# EAGLE design 555-piano-pad (EAGLE 7.6.0)
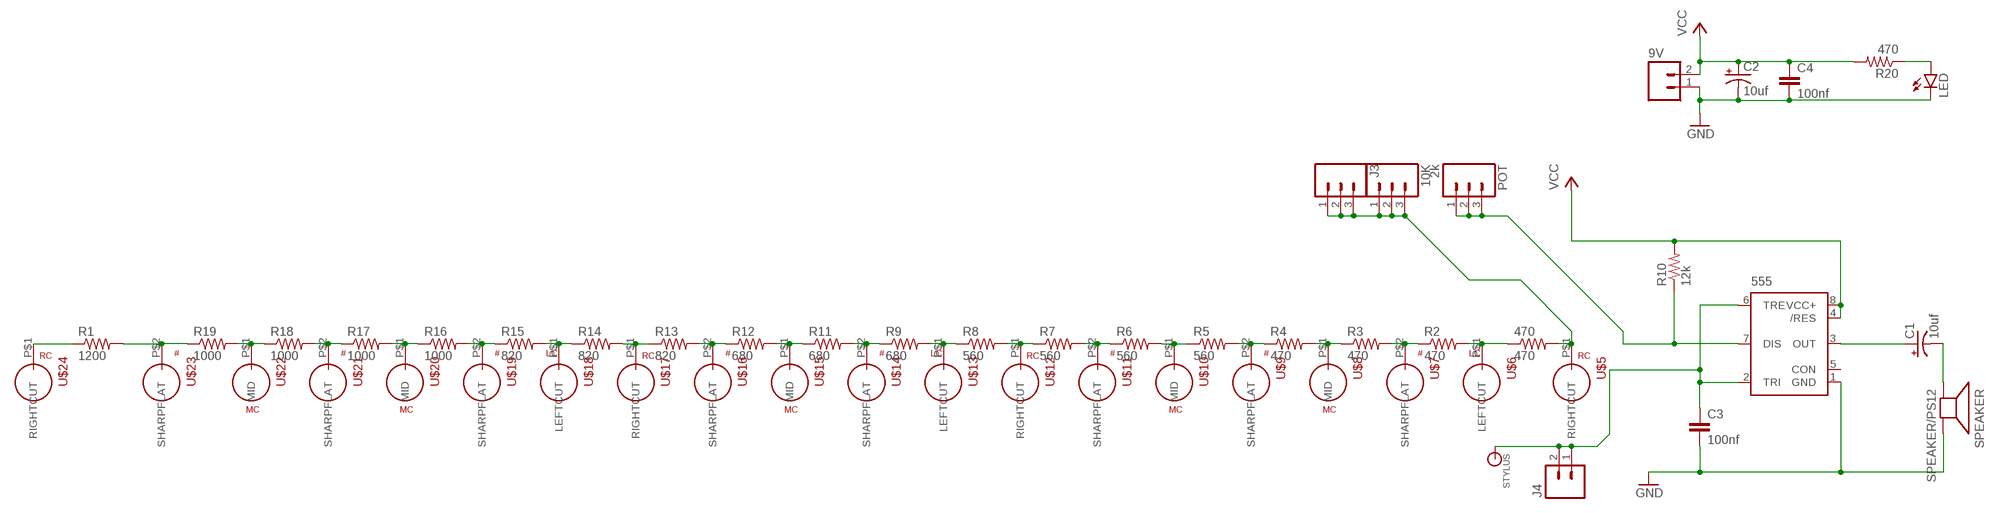
[diagram p0: schematic, sheet 1]

## Parts
9V  M02PTH3  [1X02_LONGPADS]
10K  M03PTH  [1X03]
470  470  RESISTORAXIAL-0.3  [AXIAL-0.3]
555  NE555P  [DIL-08]
C1  10uf  10UF-25V-20%(PTH)  [CPOL-RADIAL-10UF-25V]
C2  10uf  10UF-25V-20%(PTH)  [CPOL-RADIAL-10UF-25V]
C3  100nf  CAPPTH2  [CAP-PTH-SMALL2]
C4  100nf  CAPPTH2  [CAP-PTH-SMALL2]
J3  M03PTH  [1X03]
J4  M02PTH3  [1X02_LONGPADS]
LED  LED5MM  [LED5MM]
POT  2k  M03PTH  [1X03]
R1  1200  RESISTORAXIAL-0.3  [AXIAL-0.3]
R2  470  RESISTORAXIAL-0.3  [AXIAL-0.3]
R3  470  RESISTORAXIAL-0.3  [AXIAL-0.3]
R4  470  RESISTORAXIAL-0.3  [AXIAL-0.3]
R5  560  RESISTORAXIAL-0.3  [AXIAL-0.3]
R6  560  RESISTORAXIAL-0.3  [AXIAL-0.3]
R7  560  RESISTORAXIAL-0.3  [AXIAL-0.3]
R8  560  RESISTORAXIAL-0.3  [AXIAL-0.3]
R9  680  RESISTORAXIAL-0.3  [AXIAL-0.3]
R10  12k  RESISTORAXIAL-0.3  [AXIAL-0.3]
R11  680  RESISTORAXIAL-0.3  [AXIAL-0.3]
R12  680  RESISTORAXIAL-0.3  [AXIAL-0.3]
R13  820  RESISTORAXIAL-0.3  [AXIAL-0.3]
R14  820  RESISTORAXIAL-0.3  [AXIAL-0.3]
R15  820  RESISTORAXIAL-0.3  [AXIAL-0.3]
R16  1000  RESISTORAXIAL-0.3  [AXIAL-0.3]
R17  1000  RESISTORAXIAL-0.3  [AXIAL-0.3]
R18  1000  RESISTORAXIAL-0.3  [AXIAL-0.3]
R19  1000  RESISTORAXIAL-0.3  [AXIAL-0.3]
R20  470  RESISTORAXIAL-0.3  [AXIAL-0.3]
SPEAKER  SPEAKER/PS12  [PS12]
STYLUS  BANANA_CONN  [BANANA_CONN]
U$5  PINANO-RIGHT-CUT  [PINANO-RIGHT-CUT]
U$6  PINANO-LEFT-CUT  [PINANO-LEFT-CUT]
U$7  PINANO-SHARPFLAT  [PINANO-SHARPFLAT]
U$8  PINANO-MID  [PINANO-MID]
U$9  PINANO-SHARPFLAT  [PINANO-SHARPFLAT]
U$10  PINANO-MID  [PINANO-MID]
U$11  PINANO-SHARPFLAT  [PINANO-SHARPFLAT]
U$12  PINANO-RIGHT-CUT  [PINANO-RIGHT-CUT]
U$13  PINANO-LEFT-CUT  [PINANO-LEFT-CUT]
U$14  PINANO-SHARPFLAT  [PINANO-SHARPFLAT]
U$15  PINANO-MID  [PINANO-MID]
U$16  PINANO-SHARPFLAT  [PINANO-SHARPFLAT]
U$17  PINANO-RIGHT-CUT  [PINANO-RIGHT-CUT]
U$18  PINANO-LEFT-CUT  [PINANO-LEFT-CUT]
U$19  PINANO-SHARPFLAT  [PINANO-SHARPFLAT]
U$20  PINANO-MID  [PINANO-MID]
U$21  PINANO-SHARPFLAT  [PINANO-SHARPFLAT]
U$22  PINANO-MID  [PINANO-MID]
U$23  PINANO-SHARPFLAT  [PINANO-SHARPFLAT]
U$24  PINANO-RIGHT-CUT  [PINANO-RIGHT-CUT]

## Nets
GND: 9V.1 555.1(GND) C2.2(-) C3.2 C4.2 LED.K(C) SPEAKER.P$2(-)
N$1: C1.2(-) SPEAKER.P$1(+)
N$2: 10K.1 10K.2 10K.3 470.P$2 J3.1 J3.2 J3.3 U$5.P$1(RIGHTCUT)
N$3: 470.P$1 R2.P$2 U$6.P$1(LEFTCUT)
N$4: R2.P$1 R3.P$2 U$7.P$2(SHARPFLAT)
N$5: R3.P$1 R4.P$2 U$8.P$1(MID)
N$6: R4.P$1 R5.P$2 U$9.P$2(SHARPFLAT)
N$7: R5.P$1 R6.P$2 U$10.P$1(MID)
N$8: 555.3(OUT) C1.1(+)
N$9: R6.P$1 R7.P$2 U$11.P$2(SHARPFLAT)
N$10: R7.P$1 R8.P$2 U$12.P$1(RIGHTCUT)
N$11: R8.P$1 R9.P$2 U$13.P$1(LEFTCUT)
N$12: R9.P$1 R11.P$2 U$14.P$2(SHARPFLAT)
N$13: R11.P$1 R12.P$2 U$15.P$1(MID)
N$14: R12.P$1 R13.P$2 U$16.P$2(SHARPFLAT)
N$15: R13.P$1 R14.P$2 U$17.P$1(RIGHTCUT)
N$16: R14.P$1 R15.P$2 U$18.P$1(LEFTCUT)
N$17: R15.P$1 R16.P$2 U$19.P$2(SHARPFLAT)
N$18: 555.2(TRI) 555.6(TRE) C3.1 J4.1 J4.2 STYLUS.P$1
N$19: R16.P$1 R17.P$2 U$20.P$1(MID)
N$20: 555.7(DIS) POT.1 POT.2 POT.3 R10.P$1
N$21: R17.P$1 R18.P$2 U$21.P$2(SHARPFLAT)
N$22: R18.P$1 R19.P$2 U$22.P$1(MID)
N$23: R1.P$2 R19.P$1 U$23.P$2(SHARPFLAT)
N$24: R1.P$1 U$24.P$1(RIGHTCUT)
N$26: LED.A R20.P$1
VCC: 9V.2 555.4(/RES) 555.8(VCC+) C2.1(+) C4.1 R10.P$2 R20.P$2
Unconnected: 555.5(CON)

## Library data of the parts
9V J4 = SparkFun-Connectors:M02: Standard 2-pin 0.1" header. Use with - straight break away headers ( PRT-00116) - right angle break away headers (PRT-00553) - swiss pins (PRT-00743) - machine pins (PRT-00117) - female headers (PRT-00115) Molex polarized connector foot print use with: PRT-08233 with associated crimp pins and housings. 2.54_SCREWTERM for use with PRT-10571. 3.5mm Screw Terminal footprints for PRT-08084 5mm Screw Terminal footprints for use with PRT-08432
10K J3 POT = SparkFun-Connectors:M03: Header 3 Standard 3-pin 0.1" header. Use with straight break away headers (SKU : PRT-00116), right angle break away headers (PRT-00553), swiss pins (PRT-00743), machine pins (PRT-00117), and female headers (PRT-00115). Molex polarized connector foot print use with SKU : PRT-08232 with associated crimp pins and housings.
470 R1-R20 = SparkFun-Resistors:RESISTOR: Resistor Basic schematic elements and footprints for 0603, 1206, and PTH resistors.
555 = SparkFun-AnalogIC:NE555: General purpose bipolar Timer; MF: Arrow Electronics; MPN: NE555N; OC_FARNELL: 1467742; OC_NEWARK: 89K1486
C1 C2 = SparkFun-Capacitors:10UF-25V-20%(PTH): CAP-08440; PROD_ID: CAP-08440
C3 C4 = SparkFun-Passives:CAP: Capacitor Standard 0603 ceramic capacitor, and 0.1" leaded capacitor.
LED = SparkFun-LED:LED: LEDs Standard schematic elements and footprints for 5mm, 3mm, 1206, and 0603 sized LEDs. 5mm - Spark Fun Electronics SKU : COM-00529 (and others)
SPEAKER = adafruit:SPEAKER: SPEAKER Source: Buerklin Added PS12 (for part # PS1240 piezo) http://www.ladyada.net/library/pcb/eaglelibrary.html
STYLUS = SparkFun-Connectors:BANANA_CONN: Through-hole banana jack
U$5 U$12 U$17 U$24 = pinano-keys:PINANO-RIGHT-CUT
U$6 U$13 U$18 = pinano-keys:PINANO-LEFT-CUT
U$7 U$9 U$11 U$14 U$16 U$19 U$21 U$23 = pinano-keys:PINANO-SHARPFLAT
U$8 U$10 U$15 U$20 U$22 = pinano-keys:PINANO-MID

## Board
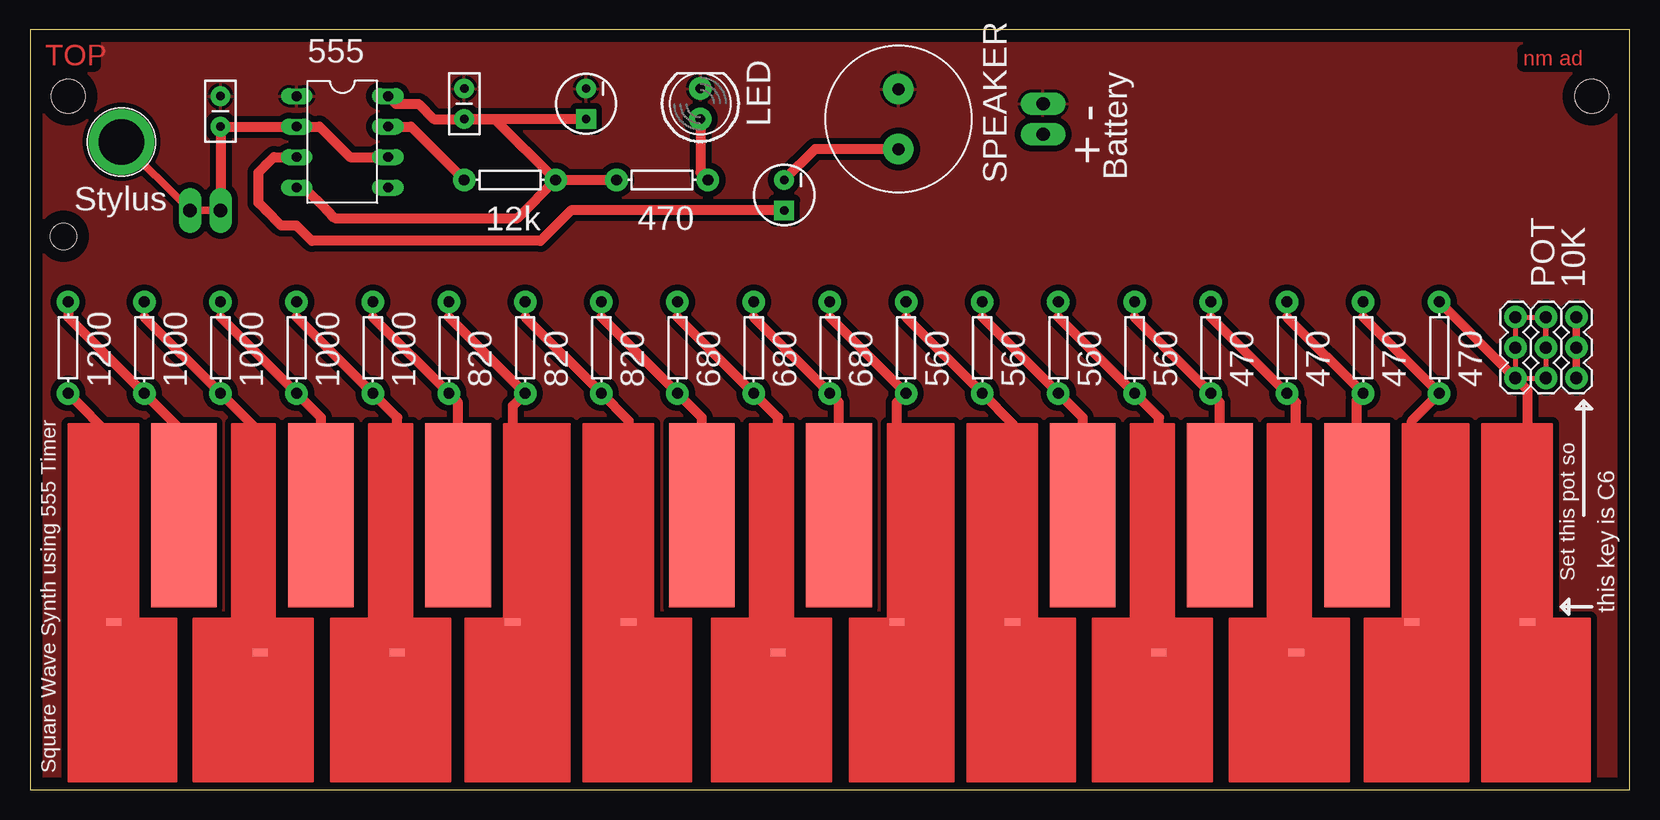
[diagram p1: board, top side]
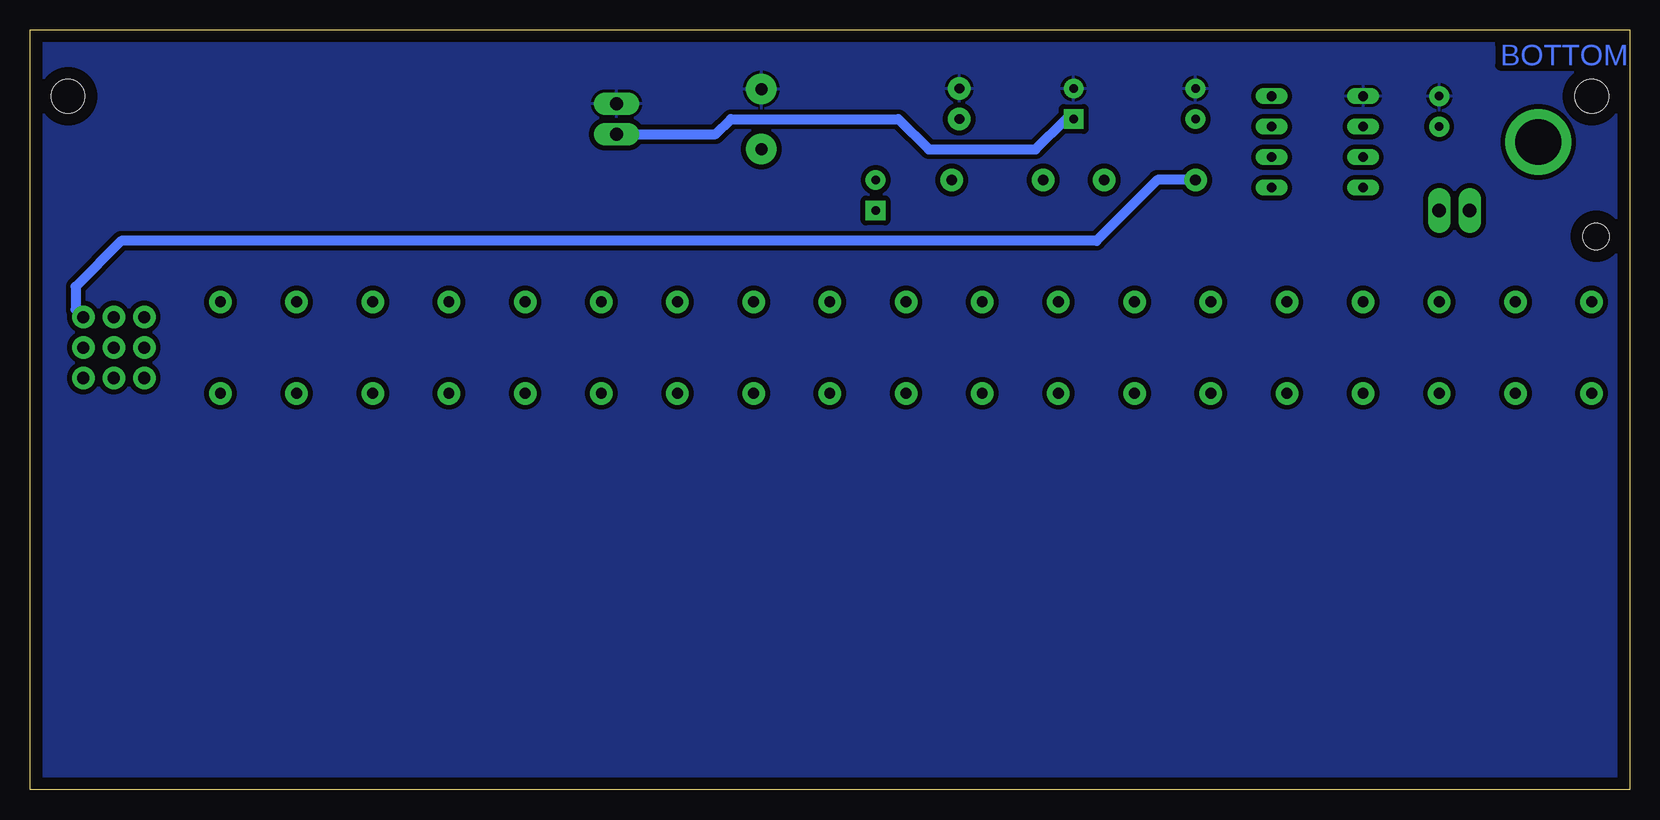
[diagram p2: board, bottom side, seen from below]

Size 133.35 x 63.3 mm. Coordinates in mm from the lower left corner, seen from the top.
Outline: 0,0 133.35,0 133.35,63.3 0,63.3 0,0
Copper layers (1*16): Top 0.035mm / dielectric 1.5mm / Bottom 0.035mm
Design rules "default": minimum track width 10mil, minimum drill 24mil, track to track 8mil, track to pad 8mil, pad to pad 8mil, via to via 8mil, smd to smd 8mil, copper to edge 40mil, drill to drill 8mil, minimum pad ring 10mil, minimum via ring 8mil, stop-mask expansion 4mil, vias tented up to drill 0mil, thermal gap 10mil
Holes 2.2 mm at 2.79,46.1
Holes 2.8 mm at 130.18,57.78 3.17,57.78

### Footprints (pad centres in the part's own frame; a part is rotated, then mirrored left to right if it is on the bottom)
1X02_LONGPADS = drill 1.118 pad 1.88 long: 1 0,0; 2 2.54,0
1X03 = drill 1.016 pad 1.88: 1 0,0; 2 2.54,0; 3 5.08,0
AXIAL-0.3 = drill 0.9 pad 1.88: P$1 -3.81,0; P$2 3.81,0
DIL-08 = drill 0.813 long: 1 -3.81,-3.81; 2 -1.27,-3.81; 3 1.27,-3.81; 4 3.81,-3.81; 5 3.81,3.81; 6 1.27,3.81; 7 -1.27,3.81; 8 -3.81,3.81
CPOL-RADIAL-10UF-25V = drill 0.7 pad 1.651 square: 1 1.27,0 | drill 0.7 pad 1.651: 2 -1.27,0
CAP-PTH-SMALL2 = drill 0.7 pad 1.651: 1 0,0; 2 2.54,0
LED5MM = drill 0.813 pad 1.88: A -1.27,0; K 1.27,0
PS12 = drill 1 pad 2.54: P$1 -2.5,0; P$2 2.5,0
BANANA_CONN = drill 3.81 pad 5.461: P$1 0,0
PINANO-RIGHT-CUT = smd 1.27 x 0.635: P$1 -1.27,-3.81
PINANO-LEFT-CUT = smd 1.27 x 0.635: P$1 1.27,-3.81
PINANO-SHARPFLAT = smd 5.461 x 15.367: P$2 0,0
PINANO-MID = smd 1.27 x 0.635: P$1 1.27,-5.08

### Placement (x,y rotation side)
9V  84.45,57.15 270 top
10K  126.36,39.37 270 top
470  117.47,36.83 90 top
555  26.04,53.98 270 top
C1  62.87,49.53 270 top
C2  46.35,57.15 270 top
C3  15.88,55.24 90 top
C4  36.2,55.88 90 top
J3  123.83,39.37 270 top
J4  15.88,48.26 180 top
LED  55.88,57.15 90 top
POT  128.91,39.37 270 top
R1  3.17,36.83 90 top
R2  111.12,36.83 90 top
R3  104.78,36.83 90 top
R4  98.42,36.83 90 top
R5  92.08,36.83 90 top
R6  85.72,36.83 90 top
R7  79.38,36.83 90 top
R8  73.03,36.83 90 top
R9  66.67,36.83 90 top
R10  40.01,50.8 0 top
R11  60.33,36.83 90 top
R12  53.98,36.83 90 top
R13  47.62,36.83 90 top
R14  41.27,36.83 90 top
R15  34.92,36.83 90 top
R16  28.57,36.83 90 top
R17  22.23,36.83 90 top
R18  15.88,36.83 90 top
R19  9.53,36.83 90 top
R20  52.7,50.8 180 top
SPEAKER  72.39,55.88 90 top
STYLUS  7.62,53.98 270 top
U$5  126.11,17.78 0 top
U$6  113.92,17.78 0 top
U$7  110.62,22.86 0 top
U$8  104.27,16.51 0 top
U$9  99.19,22.86 0 top
U$10  92.84,16.51 0 top
U$11  87.76,22.86 0 top
U$12  83.19,17.78 0 top
U$13  70.99,17.78 0 top
U$14  67.44,22.86 0 top
U$15  61.09,16.51 0 top
U$16  56.01,22.86 0 top
U$17  51.18,17.78 0 top
U$18  38.99,17.78 0 top
U$19  35.69,22.86 0 top
U$20  29.34,16.51 0 top
U$21  24.26,22.86 0 top
U$22  17.91,16.51 0 top
U$23  12.83,22.86 0 top
U$24  8.26,17.78 0 top

### Tracks (layer width: path | path; a pad name or v marks a point on that pad's centre or on a via)
GND
  pour Top (isolate 0.508): 0,0 0,63.5 133.35,63.5 133.35,0
  pour Bottom (isolate 0.406): 0,0 0,63.5 133.35,63.5 133.35,0
N$1
  Top 0.813: SPEAKER.P$1 65.44,53.38 C1.2
N$2
  Top 0.406: 10K.2 10K.1 | 10K.1 10K.3 J3.3 J3.2 J3.1 10K.1
  Top 0.813: 470.P$2 J3.3 124.84,33.27 U$5.P$1
N$3
  Top 0.406: R2.P$2 111.12,39.37
  Top 0.813: 111.12,39.37 470.P$1 115.19,30.73 U$6.P$1
N$4
  Top 0.406: R3.P$2 104.78,39.37
  Top 0.813: 104.78,39.37 R2.P$1 110.62,32.51 U$7.P$2
N$5
  Top 0.406: R4.P$2 98.42,39.37
  Top 0.813: 98.42,39.37 R3.P$1 105.54,32.26 U$8.P$1
N$6
  Top 0.406: R5.P$2 92.08,39.37
  Top 0.813: 92.08,39.37 R4.P$1 99.19,32.26 U$9.P$2
N$7
  Top 0.406: R6.P$2 85.72,39.37
  Top 0.813: 85.72,39.37 R5.P$1 94.11,30.99 U$10.P$1
N$8
  Top 0.813: C1.1 45.09,48.26 42.55,45.72 23.5,45.72 22.23,46.99 20.95,46.99 19.68,48.26 19.05,48.9 19.05,51.44 19.68,52.07 20.32,52.7 555.3
N$9
  Top 0.406: R7.P$2 79.38,39.37
  Top 0.813: 79.38,39.37 R6.P$1 87.76,30.99 U$11.P$2
N$10
  Top 0.406: R8.P$2 73.03,39.37
  Top 0.813: 73.03,39.37 R7.P$1 81.92,30.48 U$12.P$1
N$11
  Top 0.406: R9.P$2 66.67,39.37
  Top 0.813: 66.67,39.37 R8.P$1 72.26,32.26 U$13.P$1
N$12
  Top 0.406: R11.P$2 60.33,39.37
  Top 0.813: 60.33,39.37 R9.P$1 67.44,32.26 U$14.P$2
N$13
  Top 0.406: R12.P$2 53.98,39.37
  Top 0.813: 53.98,39.37 R11.P$1 62.36,30.99 U$15.P$1
N$14
  Top 0.406: R13.P$2 47.62,39.37
  Top 0.813: 47.62,39.37 R12.P$1 56.01,30.99 U$16.P$2
N$15
  Top 0.406: R14.P$2 41.27,39.37
  Top 0.813: 41.27,39.37 R13.P$1 49.91,30.73 U$17.P$1
N$16
  Top 0.406: R15.P$2 34.92,39.37
  Top 0.813: 34.92,39.37 R14.P$1 40.26,32 U$18.P$1
N$17
  Top 0.406: R16.P$2 28.57,39.37
  Top 0.813: 28.57,39.37 R15.P$1 35.69,32.26 U$19.P$2
N$18
  Top 0.61: J4.1 J4.2 STYLUS.P$1
  Top 0.813: J4.1 C3.1 555.2 24.13,55.24 26.67,52.7 555.6
N$19
  Top 0.406: R17.P$2 22.23,39.37
  Top 0.813: 22.23,39.37 R16.P$1 30.61,30.99 U$20.P$1
N$20
  Top 0.61: POT.3 POT.2 POT.1
  Top 0.813: 555.7 31.75,55.24 R10.P$1
  Bottom 0.813: R10.P$1 39.37,50.8 44.45,45.72 125.73,45.72 129.54,41.91 129.54,40.01 POT.1
N$21
  Top 0.406: R18.P$2 15.88,39.37
  Top 0.813: 15.88,39.37 R17.P$1 24.26,30.99 U$21.P$2
N$22
  Top 0.406: R19.P$2 9.53,39.37
  Top 0.813: 9.53,39.37 R18.P$1 19.18,29.72 U$22.P$1
N$23
  Top 0.61: 10.16,32.38 R19.P$1
  Top 0.813: R1.P$2 3.17,39.37 R19.P$1 | 10.16,32.38 12.83,29.72 U$23.P$2
N$24
  Top 0.813: R1.P$1 6.99,29.21 U$24.P$1
N$26
  Top 0.813: LED.A 55.88,51.44 R20.P$1
VCC
  Top 0.813: 555.4 22.86,50.16 24.77,48.26 25.4,47.62 40.64,47.62 R10.P$2 | 555.8 30.48,57.15 32.38,57.15 33.66,55.88 C4.1 36.83,55.88 | 36.83,55.88 38.73,55.88 R10.P$2 | R10.P$2 R20.P$2 | C2.1 36.83,55.88
  Bottom 0.813: 9V.2 76.2,54.61 74.93,55.88 60.96,55.88 58.42,53.34 49.53,53.34 46.99,55.88 C2.1

### Text on the board
Top: TOP | nm ad
Bottom: BOTTOM
tNames: + - | Battery | Stylus | Set this pot so | this key is C6 | Square Wave Synth using 555 Timer